# Altium schematic sheet Gyroscope.SchDoc
size A; SheetNumber: 12; SheetTotal: 12
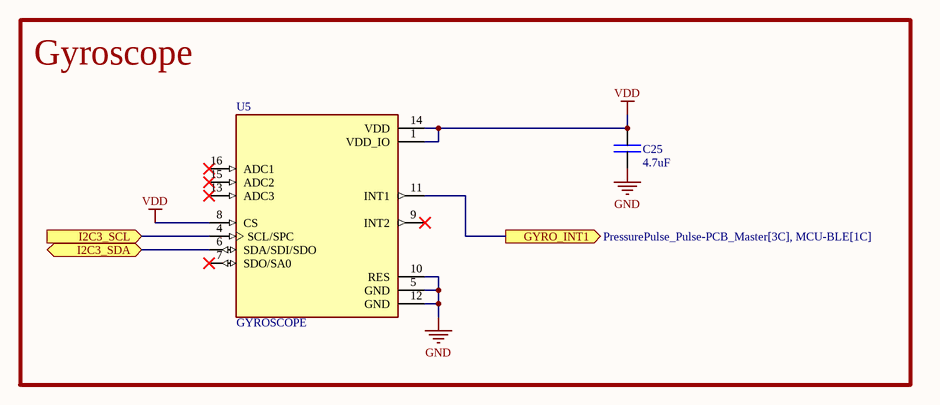
[diagram p0: Gyroscope.SchDoc]

## Parts
C25  value 4.7uF  [0402C]  (hidden comment: CAP)
U5  GYROSCOPE  [16-VFLGA]

## Blocks framed on the sheet
Gyroscope: C25 U5

## Ports
GYRO_INT1 (out, see PressurePulse_Pulse-PCB_Master[3C], MCU-BLE[1C]), I2C3_SCL (in, see PressurePulse_Pulse-PCB_Master[3C], Fuel-Gauge[4B], MCU-BLE[3C]), I2C3_SDA (bidir, see PressurePulse_Pulse-PCB_Master[3C], Fuel-Gauge[4B], MCU-BLE[3C])

## Nets
GND: C25.1 U5.5(GND) U5.10(RES) U5.12(GND)
VDD: C25.2 U5.1(VDD_IO) U5.8(CS) U5.14(VDD)
GYRO_INT1: U5.11(INT1) ; port GYRO_INT1
I2C3_SCL: U5.4(SCL/SPC) ; port I2C3_SCL
I2C3_SDA: U5.6(SDA/SDI/SDO) ; port I2C3_SDA

Not connected (* = marked no-connect by the designer): U5 7(SDO/SA0)* 9(INT2)* 13(ADC3)* 15(ADC2)* 16(ADC1)*

## Library data of the parts
C25 = CAP: Capacitor; MFR: *; MFR PN: *; JLCPCB PN: *; Footprint: *
U5 = GYROSCOPE: Accelerometer X, Y, Z Axis Â±2g, 4g, 8g, 16g 0.5Hz ~ 625Hz 16-LGA (3x3); MFR: STMicroelectronics; Value: LIS3DHTR; MFR PN: LIS3DHTR; JLCPCB PN: C15134